# Altium schematic sheet LSM6DSOX.SchDoc
size A; SheetNumber: 1; SheetTotal: 2
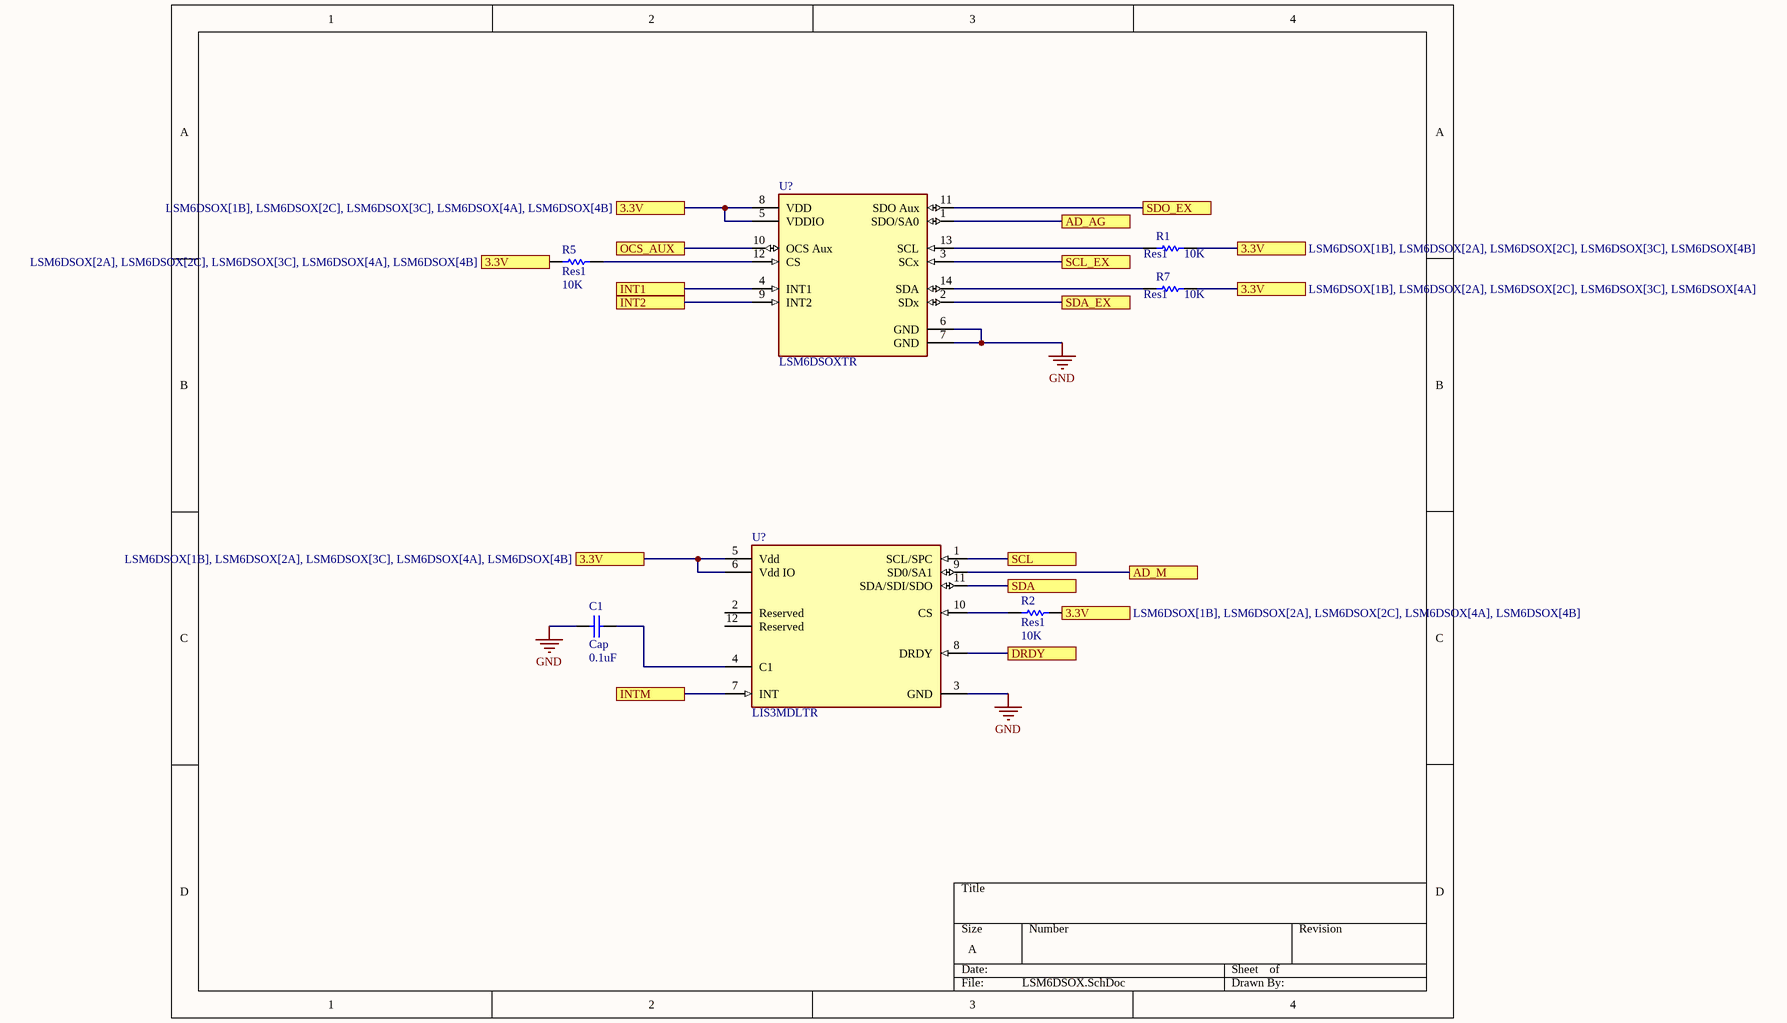
[diagram p0: LSM6DSOX.SchDoc]

## Parts
(Parts that share a designator on the sheet are numbered #1, #2 ... from top to bottom, then left to right.)
C1  Cap  value 0.1uF  [RAD-0.3]
R1  Res1  value 10K  [AXIAL-0.3]
R2  Res1  value 10K  [AXIAL-0.3]
R5  Res1  value 10K  [AXIAL-0.3]
R7  Res1  value 10K  [AXIAL-0.3]
U?#1  LSM6DSOXTR  [FP-LGA-14L-DM00249496-MFG]
U?#2  LIS3MDLTR  [FP-VFLGA-12-8365767-MFG]

## Ports
3.3V (see LSM6DSOX[1B], LSM6DSOX[2A], LSM6DSOX[2C], LSM6DSOX[3C], LSM6DSOX[4A]), 3.3V (see LSM6DSOX[1B], LSM6DSOX[2A], LSM6DSOX[2C], LSM6DSOX[3C], LSM6DSOX[4B]), 3.3V (see LSM6DSOX[1B], LSM6DSOX[2A], LSM6DSOX[2C], LSM6DSOX[4A], LSM6DSOX[4B]), 3.3V (see LSM6DSOX[1B], LSM6DSOX[2A], LSM6DSOX[3C], LSM6DSOX[4A], LSM6DSOX[4B]), 3.3V (see LSM6DSOX[1B], LSM6DSOX[2C], LSM6DSOX[3C], LSM6DSOX[4A], LSM6DSOX[4B]), 3.3V (see LSM6DSOX[2A], LSM6DSOX[2C], LSM6DSOX[3C], LSM6DSOX[4A], LSM6DSOX[4B]), AD_AG, AD_M, DRDY, INT1, INT2, INTM, OCS_AUX, SCL, SCL_EX, SDA, SDA_EX, SDO_EX

## Nets
GND: C1.1 U?#1.6(GND) U?#1.7(GND) U?#2.3(GND)
3.3V: R1.2 R2.2 R5.1 R7.2 U?#1.5(VDDIO) U?#1.8(VDD) U?#2.5(Vdd) U?#2.6(Vdd_IO) ; port 3.3V
AD_AG: U?#1.1(SDO/SA0) ; port AD_AG
AD_M: U?#2.9(SD0/SA1) ; port AD_M
DRDY: U?#2.8(DRDY) ; port DRDY
INT1: U?#1.4(INT1) ; port INT1
INT2: U?#1.9(INT2) ; port INT2
INTM: U?#2.7(INT) ; port INTM
OCS_AUX: U?#1.10(OCS_Aux) ; port OCS_AUX
SCL: U?#2.1(SCL/SPC) ; port SCL
SCL_EX: U?#1.3(SCx) ; port SCL_EX
SDA: U?#2.11(SDA/SDI/SDO) ; port SDA
SDA_EX: U?#1.2(SDx) ; port SDA_EX
SDO_EX: U?#1.11(SDO_Aux) ; port SDO_EX
NetC1_2: C1.2 U?#2.4(C1)
NetR1_1: R1.1 U?#1.13(SCL)
NetR2_1: R2.1 U?#2.10(CS)
NetR5_2: R5.2 U?#1.12(CS)
NetR7_1: R7.1 U?#1.14(SDA)

Not connected (* = marked no-connect by the designer): U?#2 2(Reserved) 12(Reserved)

## Library data of the parts
C1 = Cap: Capacitor; Published: 8-Jun-2000; LatestRevisionDate: 17-Jul-2002; LatestRevisionNote: Re-released for DXP Platform.; PackageReference: RAD-0.3; Publisher: Altium Limited; PackageDescription: Radial Cap, Thru-Hole; 2 Leads; 0.3 in Pin Spacing
R1 R2 R5 R7 = Res1: Resistor; Published: 8-Jun-2000; LatestRevisionDate: 17-Jul-2002; LatestRevisionNote: Re-released for DXP Platform.; PackageReference: AXIAL-0.3; Publisher: Altium Limited; PackageDescription: Axial Device, Thru-Hole; 2 Leads; 0.3 in Pin Spacing
U?#1 = CMP-12177-000010-1: INEMO INERTIAL MODULE: 3D ACCELE; Manufacturer: STMicroelectronics; Sensor Type: Temperature,Accelerometer,Gyroscope; Accel Range: 2/4/8/16g; Accel Sensitivity: 0.061/0.122/0.244/0.488mV/g; Operating Supply Current: 0.55mA; Gyro Range: 125/250/500/1000/2000°/s; Gyro Sensitivity: 4.375/8.75/17.5/35/70LSB/°/s; Sensor Output: I2C,SPI,Other; Min Supply Voltage: 1.62V; Max Supply Voltage: 3.6V; Octopart: https://octopart.com/lsm6dsoxtr-stmicroelectronics-98102600; Package: LGA-14L-DM00249496; Footprint Url: https://www.st.com/content/ccc/resource/technical/document/technical_note/73/17/9c/16/dd/96/4a/01/CD00134799.pdf/files/CD00134799.pdf/jcr:content/translations/en.CD00134799.pdf; ComponentLink2Description: Datasheet; Mouser Description: LSM6DSOX: 3.6 V 3 Axis Accelerometer Gyroscope iNEMO Inertial Module - LGA-14L; ComponentLink2URL: https://www.st.com/resource/en/datasheet/lsm6dsox.pdf; Temperature Range Low: -40°C; Digikey Description: INEMO INERTIAL MODULE: 3D ACCELE; Lead Free: Yes; Device Class L3: Inertial Measurement Units (IMUs); Category: IC; Device Class L2: Motion Sensors; RoHS: TRUE; Temperature: -40°C to +85°C; Height: 0.86mm; Device Class L1: Sensors; Temperature Range High: +85°C; Manufacturer Part Number: LSM6DSOXTR; Automotive: No
U?#2 = CMP-2000-07463-2: SENSOR MR I2C/SPI 12LGA; Manufacturer: STMicroelectronics; Sensor Output: I2C,SPI; Operating Supply Current: 40-270uA; Max Supply Voltage: 3.6V; Sensing Method: Magnetic; Min Supply Voltage: 1.71V; ComponentLink2URL: https://www.st.com/resource/en/datasheet/lis3mdl.pdf; Category: IC; Manufacturer Part Number: LIS3MDLTR; Octopart: https://octopart.com/lis3mdltr-stmicroelectronics-29403125; Automotive: No; ComponentLink2Description: Datasheet; RoHS: TRUE; Device Class L3: unset; Device Class L1: Sensors; Temperature: -40°C to +85°C; Height: 1mm; Mouser Description: Board Mount Hall Effect / Magnetic Sensors Ultra Lo-Pwr Hi Perf 3-Axis 1.9-3.6V; Temperature Range High: +85°C; Lead Free: Yes; Device Class L2: Magnetic Sensors; Footprint Url: https://www.st.com/content/ccc/resource/technical/document/technical_note/73/17/9c/16/dd/96/4a/01/CD00134799.pdf/files/CD00134799.pdf/jcr:content/translations/en.CD00134799.pdf; Temperature Range Low: -40°C; Package: VFLGA-12-8365767; Digikey Description: SENSOR MR I2C/SPI 12LGA